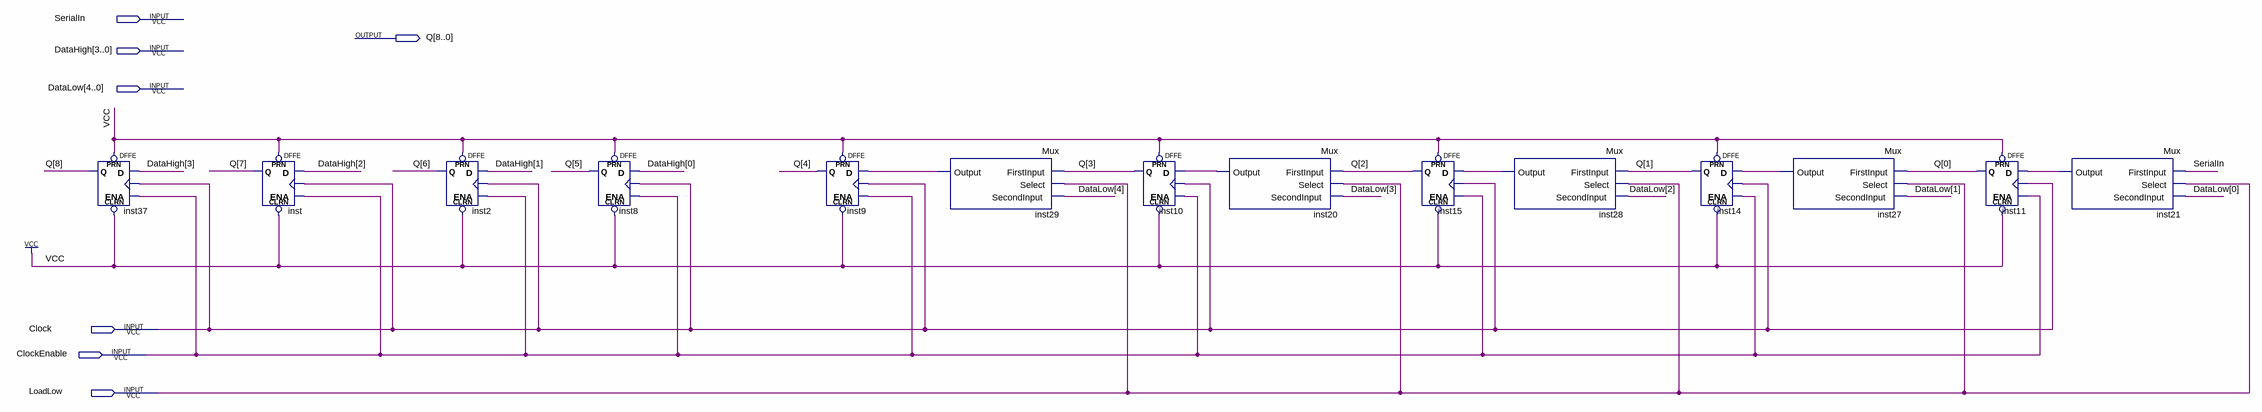
[diagram p0: schematic sheet]
// Quartus schematic NineBitRegister.bdf as structural Verilog: 14 symbols, 7 pins
module NineBitRegister (
  input  SerialIn,
  input  [3:0] DataHigh,
  input  [4:0] DataLow,
  input  Clock,
  input  ClockEnable,
  input  LoadLow,
  output [8:0] Q
);

  wire inst20_output, inst21_output, inst27_output, inst28_output, inst29_output;

  DFFE inst37 (.PRN(1'b1), .CLRN(1'b1), .D(DataHigh[3]), .CLK(Clock), .ENA(ClockEnable), .Q(Q[8]));
  DFFE inst (.PRN(1'b1), .CLRN(1'b1), .D(DataHigh[2]), .CLK(Clock), .ENA(ClockEnable), .Q(Q[7]));
  DFFE inst2 (.PRN(1'b1), .CLRN(1'b1), .D(DataHigh[1]), .CLK(Clock), .ENA(ClockEnable), .Q(Q[6]));
  DFFE inst8 (.PRN(1'b1), .CLRN(1'b1), .D(DataHigh[0]), .CLK(Clock), .ENA(ClockEnable), .Q(Q[5]));
  DFFE inst9 (.PRN(1'b1), .CLRN(1'b1), .D(inst29_output), .CLK(Clock), .ENA(ClockEnable), .Q(Q[4]));
  Mux inst29 (.FirstInput(Q[3]), .Select(LoadLow), .SecondInput(DataLow[4]), .Output(inst29_output));
  DFFE inst10 (.PRN(1'b1), .CLRN(1'b1), .D(inst20_output), .CLK(Clock), .ENA(ClockEnable), .Q(Q[3]));
  Mux inst20 (.FirstInput(Q[2]), .Select(LoadLow), .SecondInput(DataLow[3]), .Output(inst20_output));
  DFFE inst15 (.PRN(1'b1), .CLRN(1'b1), .D(inst28_output), .CLK(Clock), .ENA(ClockEnable), .Q(Q[2]));
  Mux inst28 (.FirstInput(Q[1]), .Select(LoadLow), .SecondInput(DataLow[2]), .Output(inst28_output));
  DFFE inst14 (.PRN(1'b1), .CLRN(1'b1), .D(inst27_output), .CLK(Clock), .ENA(ClockEnable), .Q(Q[1]));
  Mux inst27 (.FirstInput(Q[0]), .Select(LoadLow), .SecondInput(DataLow[1]), .Output(inst27_output));
  DFFE inst11 (.PRN(1'b1), .CLRN(1'b1), .D(inst21_output), .CLK(Clock), .ENA(ClockEnable), .Q(Q[0]));
  Mux inst21 (.FirstInput(SerialIn), .Select(LoadLow), .SecondInput(DataLow[0]), .Output(inst21_output));
endmodule
